# EAGLE design A4988 Definitivo (EAGLE 9.5.2)
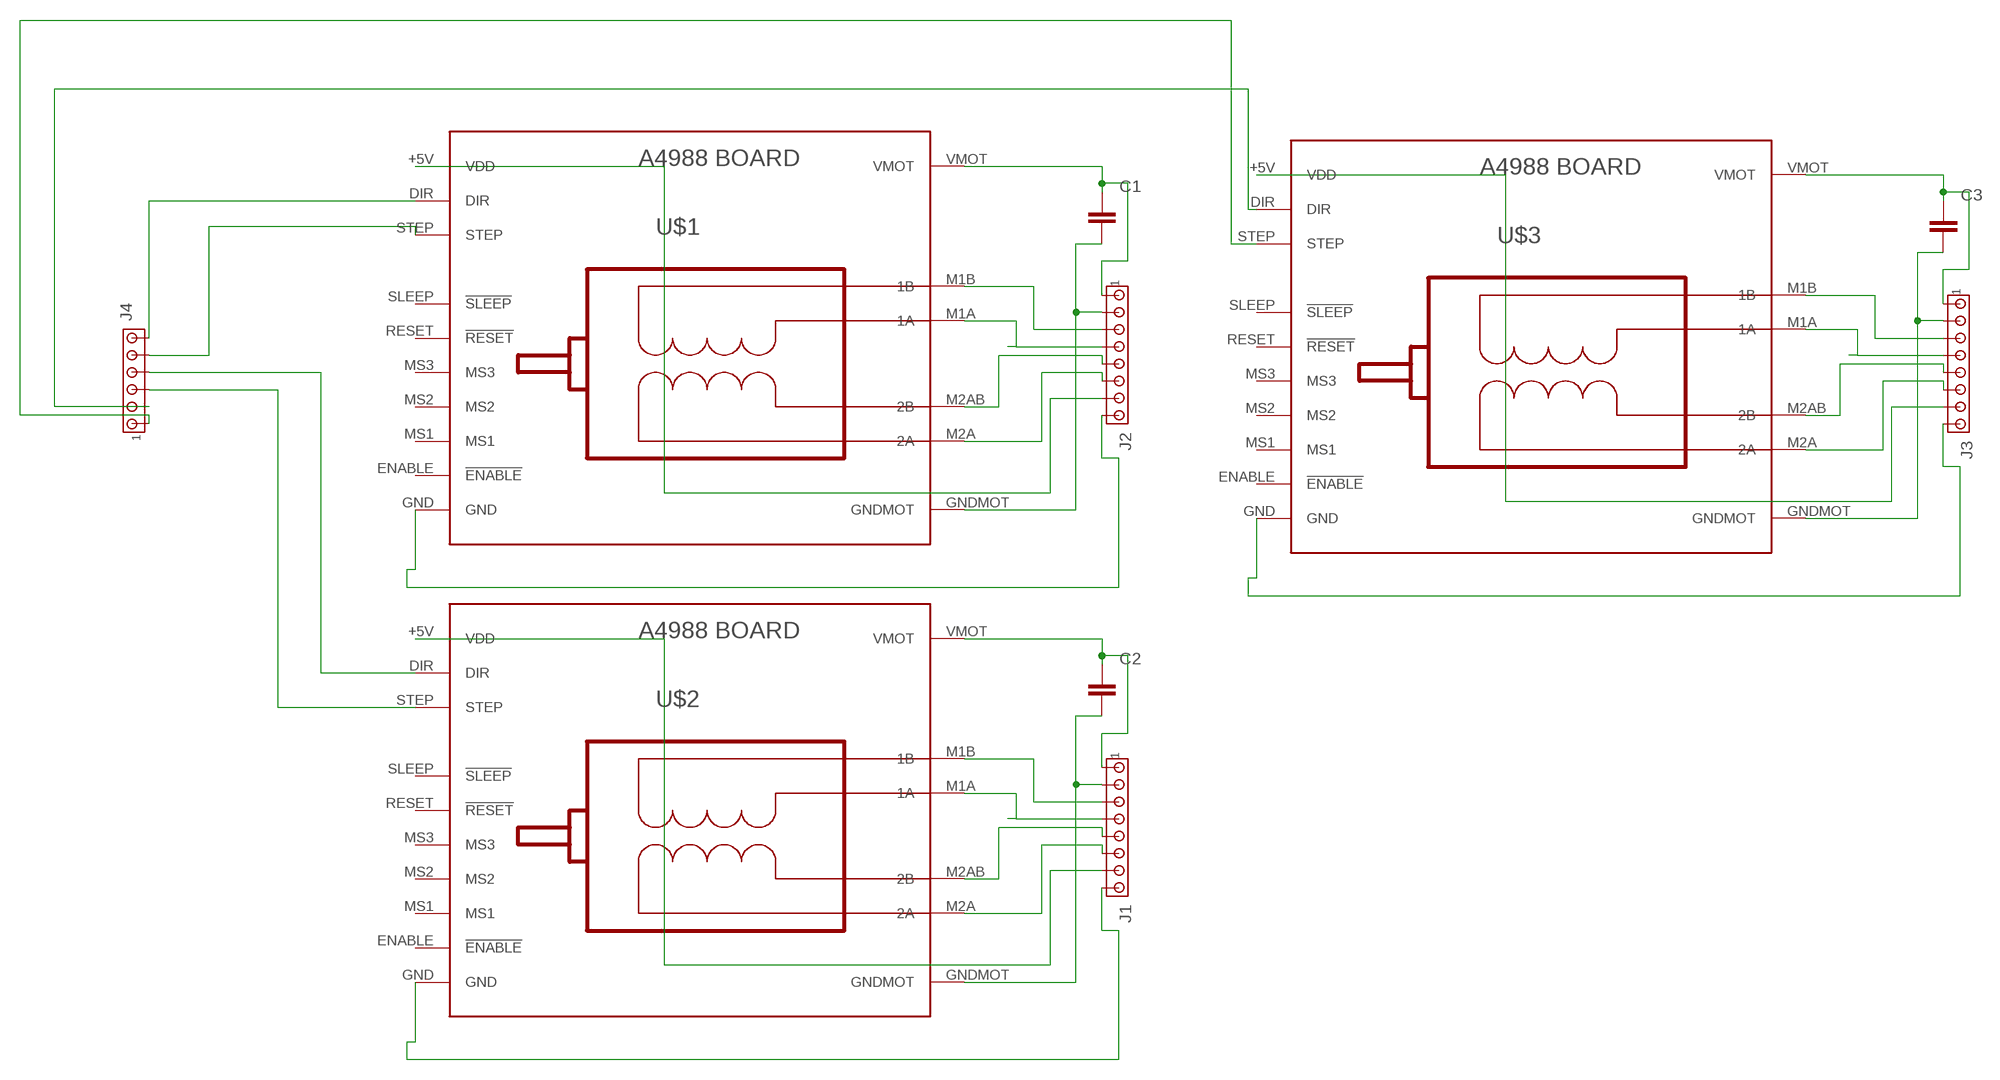
[diagram p0: schematic, sheet 1]

## Parts
C1  C_RADIAL-12.5MM-DIA  [CAPRD550W60D1025H1250B]
C2  C_RADIAL-12.5MM-DIA  [CAPRD550W60D1025H1250B]
C3  C_RADIAL-12.5MM-DIA  [CAPRD550W60D1025H1250B]
J1  MTA08-100  [10X08MTA]
J2  MTA08-100  [10X08MTA]
J3  MTA08-100  [10X08MTA]
J4  MTA06-156  [1X6MTA]
U$1  BOARD_A4988  [BOARD_A4988]
U$2  BOARD_A4988  [BOARD_A4988]
U$3  BOARD_A4988  [BOARD_A4988]

## Nets
N$1: C2.1 J1.1 U$2.VMOT
N$2: C2.2 J1.2 U$2.GNDMOT
N$3: J1.3 U$2.M1B(1B)
N$4: J1.4 U$2.M1A(1A)
N$5: J1.5 U$2.M2AB(2B)
N$6: J1.6 U$2.M2A(2A)
N$7: J1.7 U$2.+5V(VDD)
N$8: J1.8 U$2.GND
N$9: C3.1 J3.1 U$3.VMOT
N$10: C1.1 J2.1 U$1.VMOT
N$11: C1.2 J2.2 U$1.GNDMOT
N$12: C3.2 J3.2 U$3.GNDMOT
N$13: J2.3 U$1.M1B(1B)
N$14: J2.4 U$1.M1A(1A)
N$15: J2.5 U$1.M2AB(2B)
N$16: J2.6 U$1.M2A(2A)
N$17: J2.7 U$1.+5V(VDD)
N$18: J2.8 U$1.GND
N$19: J3.3 U$3.M1B(1B)
N$20: J3.4 U$3.M1A(1A)
N$21: J3.5 U$3.M2AB(2B)
N$22: J3.6 U$3.M2A(2A)
N$23: J3.7 U$3.+5V(VDD)
N$24: J3.8 U$3.GND
N$25: J4.6 U$1.DIR
N$26: J4.5 U$1.STEP
N$27: J4.4 U$2.DIR
N$28: J4.3 U$2.STEP
N$29: J4.2 U$3.DIR
N$30: J4.1 U$3.STEP
Unconnected: U$1.ENABLE(!ENABLE) U$1.MS1 U$1.MS2 U$1.MS3 U$1.RESET(!RESET) U$1.SLEEP(!SLEEP) U$2.ENABLE(!ENABLE) U$2.MS1 U$2.MS2 U$2.MS3 U$2.RESET(!RESET) U$2.SLEEP(!SLEEP) U$3.ENABLE(!ENABLE) U$3.MS1 U$3.MS2 U$3.MS3 U$3.RESET(!RESET) U$3.SLEEP(!SLEEP)

## Library data of the parts
C1-C3 = Capacitor:C: Capacitor - Generic; CATEGORY: Capacitor
J1-J3 = con-amp:MTA08-100: AMP connector
J4 = con-amp:MTA06-156: AMP connector
U$1-U$3 = Clean-Kong:BOARD_A4988

## Board
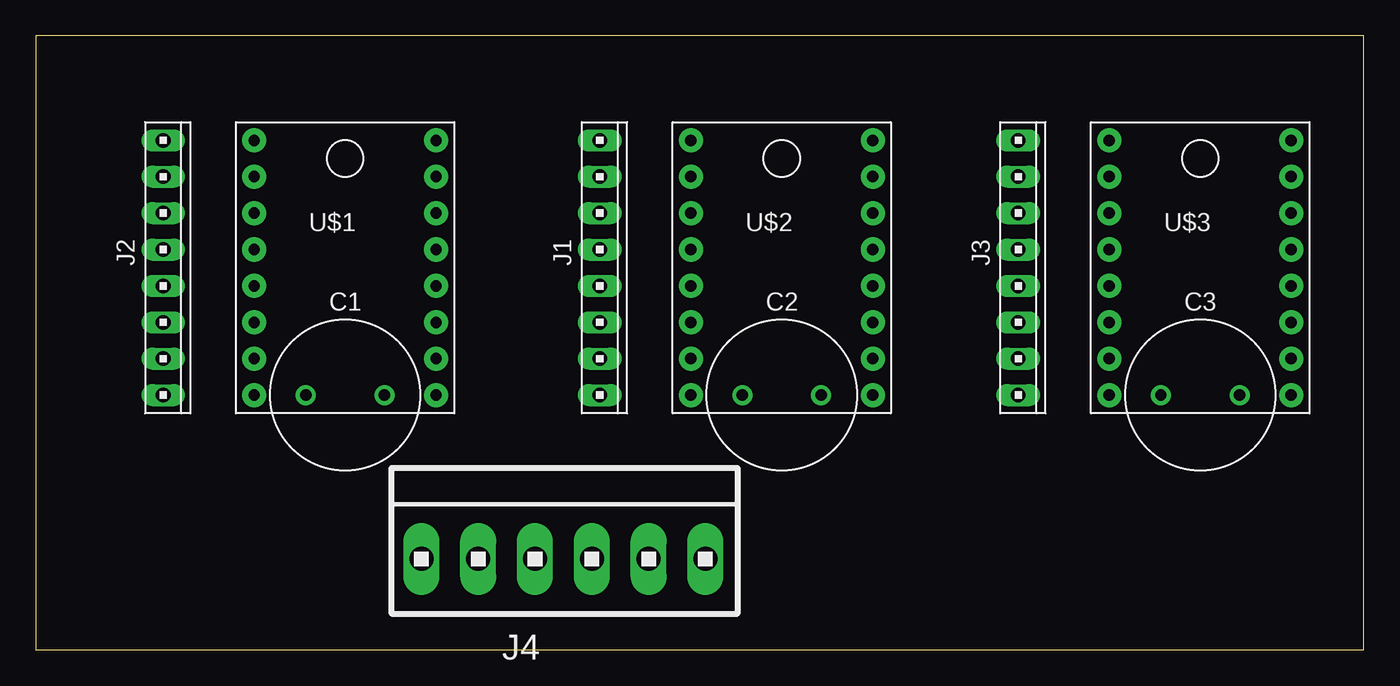
[diagram p1: board, top side]
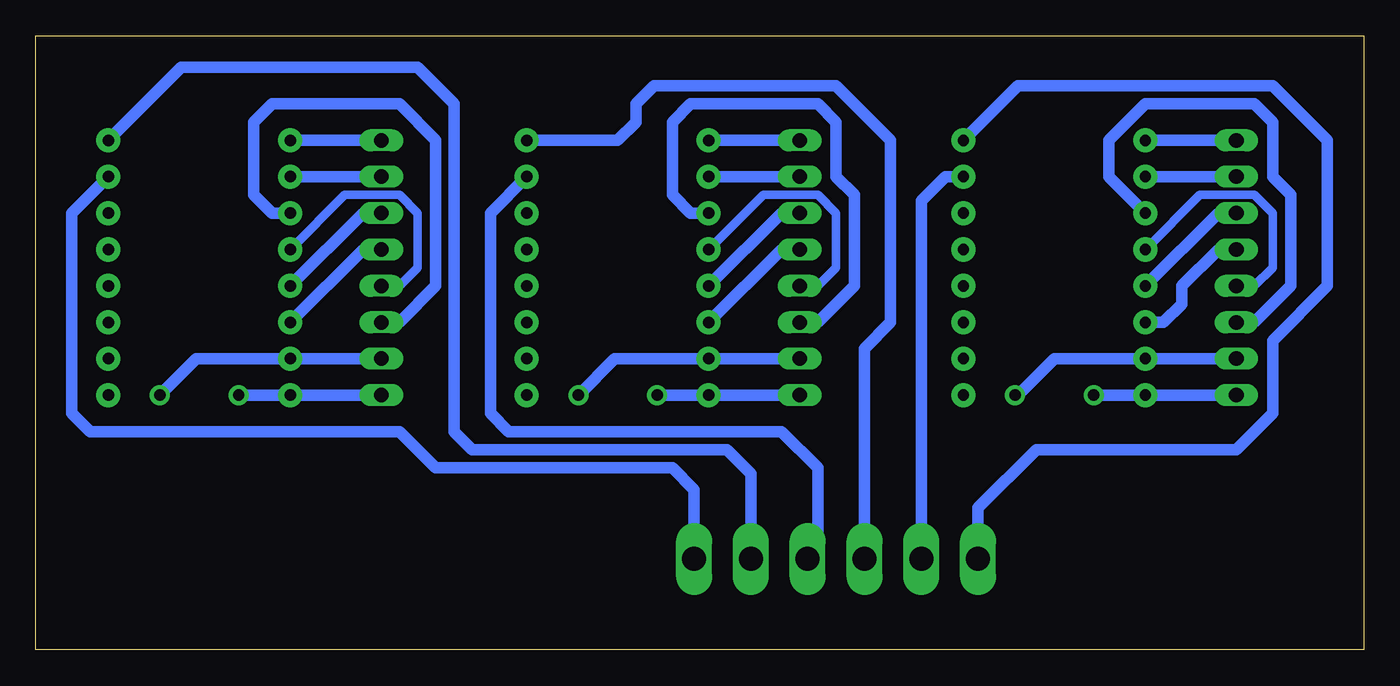
[diagram p2: board, bottom side, seen from below]

Size 92.69 x 42.85 mm. Coordinates in mm from the lower left corner, seen from the top.
Outline: 0,0 92.69,0 92.69,42.85 0,42.85 0,0
Copper layers (1*16): Top 0.035mm / dielectric 1.5mm / Bottom 0.035mm
Design rules "default": minimum track width 6mil, minimum drill 0.35mm, track to track 6mil, track to pad 6mil, pad to pad 6mil, via to via 6mil, smd to smd 6mil, copper to edge 40mil, drill to drill 6mil, minimum pad ring 10mil, minimum via ring 8mil, stop-mask expansion 4mil, vias tented up to drill 0mil, thermal gap 10mil

### Footprints (pad centres in the part's own frame; a part is rotated, then mirrored left to right if it is on the bottom)
CAPRD550W60D1025H1250B = drill 0.8 pad 1.4: 1 -2.75,0; 2 2.75,0
10X08MTA = drill 1.016 long: 1 8.89,0; 2 6.35,0; 3 3.81,0; 4 1.27,0; 5 -1.27,0; 6 -3.81,0; 7 -6.35,0; 8 -8.89,0
1X6MTA = drill 1.676 long: 1 9.906,0; 2 5.944,0; 3 1.981,0; 4 -1.981,0; 5 -5.944,0; 6 -9.906,0
BOARD_A4988 = drill 0.8 pad 1.676: +5V 1.27,16.51; DIR 13.97,19.05; ENABLE 13.97,1.27; GND 1.27,19.05; GNDMOT 1.27,3.81; M1A 1.27,11.43; M1B 1.27,13.97; M2A 1.27,8.89; M2AB 1.27,6.35; MS1 13.97,3.81; MS2 13.97,6.35; MS3 13.97,8.89; RESET 13.97,11.43; SLEEP 13.97,13.97; STEP 13.97,16.51; VMOT 1.27,1.27

### Placement (x,y rotation side)
C1  21.59,17.78 0 top
C2  52.07,17.78 0 top
C3  81.28,17.78 0 top
J1  39.37,26.67 270 top
J2  8.89,26.67 270 top
J3  68.58,26.67 270 top
J4  36.83,6.35 0 top
U$1  13.97,16.51 0 top
U$2  44.45,16.51 0 top
U$3  73.66,16.51 0 top

### Tracks (layer width: path | path; a pad name or v marks a point on that pad's centre or on a via)
N$1
  Bottom 0.813: J1.1 U$2.VMOT C2.1
N$2
  Bottom 0.813: C2.2 52.28,20.32 U$2.GNDMOT J1.2
N$3
  Bottom 0.813: J1.3 38.1,22.86 35.56,25.4 35.56,31.75 36.83,33.02 36.83,36.83 38.1,38.1 46.99,38.1 48.26,36.83 48.26,31.75 46.99,30.48 U$2.M1B
N$4
  Bottom 0.61: J1.4 38.1,25.4 36.83,26.67 36.83,30.48 38.1,31.75 41.91,31.75 U$2.M1A
N$5
  Bottom 0.813: J1.5 40.64,27.94 U$2.M2AB
N$6
  Bottom 0.813: U$2.M2A 40.64,30.48 J1.6
N$7
  Bottom 0.813: J1.7 U$2.+5V
N$8
  Bottom 0.813: J1.8 U$2.GND
N$9
  Bottom 0.813: J3.1 U$3.VMOT C3.1
N$10
  Bottom 0.813: C1.1 U$1.VMOT J2.1
N$11
  Bottom 0.813: C1.2 24.13,17.78 21.59,20.32 U$1.GNDMOT J2.2
N$12
  Bottom 0.813: J3.2 U$3.GNDMOT 81.49,20.32 C3.2
N$13
  Bottom 0.813: J2.3 7.62,22.86 5.08,25.4 5.08,31.75 6.35,33.02 6.35,36.83 7.62,38.1 15.24,38.1 17.78,35.56 17.78,33.02 U$1.M1B
N$14
  Bottom 0.61: J2.4 7.62,25.4 6.35,26.67 6.35,30.48 7.62,31.75 11.43,31.75 U$1.M1A
N$15
  Bottom 0.813: J2.5 10.16,27.94 12.7,25.4 12.7,24.13 13.97,22.86 U$1.M2AB
N$16
  Bottom 0.813: J2.6 10.16,30.48 U$1.M2A
N$17
  Bottom 0.813: J2.7 U$1.+5V
N$18
  Bottom 0.813: J2.8 U$1.GND
N$19
  Bottom 0.813: J3.3 67.31,22.86 64.77,25.4 64.77,35.56 67.31,38.1 76.2,38.1 77.47,36.83 77.47,31.75 76.2,30.48 U$3.M1B
N$20
  Bottom 0.61: J3.4 67.31,25.4 66.04,26.67 66.04,30.48 67.31,31.75 71.12,31.75 U$3.M1A
N$21
  Bottom 0.813: J3.5 69.85,27.94 U$3.M2AB
N$22
  Bottom 0.813: J3.6 69.85,30.48 U$3.M2A
N$23
  Bottom 0.813: J3.7 U$3.+5V
N$24
  Bottom 0.813: J3.8 U$3.GND
N$25
  Bottom 0.813: U$1.DIR 24.13,39.37 6.35,39.37 2.54,35.56 2.54,25.4 6.35,21.59 6.35,16.51 8.89,13.97 22.86,13.97 26.92,9.91 J4.6
N$26
  Bottom 0.813: J4.5 30.89,31.34 29.21,33.02 U$1.STEP
N$27
  Bottom 0.813: J4.4 34.85,21.03 33.02,22.86 33.02,35.56 36.83,39.37 49.53,39.37 50.8,38.1 50.8,36.83 52.07,35.56 U$2.DIR
N$28
  Bottom 0.813: J4.3 38.1,7.06 38.1,12.7 40.64,15.24 59.69,15.24 60.96,16.51 60.96,30.48 U$2.STEP
N$29
  Bottom 0.813: J4.2 42.77,12.29 44.45,13.97 62.23,13.97 63.5,15.24 63.5,38.1 66.04,40.64 82.55,40.64 U$3.DIR
N$30
  Bottom 0.813: J4.1 46.74,11.18 48.26,12.7 64.77,12.7 67.31,15.24 88.9,15.24 90.17,16.51 90.17,30.48 U$3.STEP